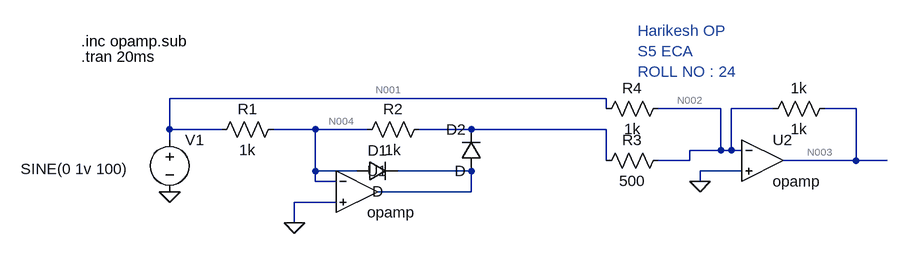
[diagram p0: schematic FULL_WAVE.asc]
FULL_WAVE.asc, the LTspice schematic file:
Version 4
SHEET 1 964 680
WIRE 528 112 -144 112
WIRE 528 128 528 112
WIRE 704 128 608 128
WIRE 784 128 720 128
WIRE 912 128 864 128
WIRE -144 160 -144 112
WIRE -64 160 -144 160
WIRE 80 160 16 160
WIRE 160 160 80 160
WIRE 320 160 240 160
WIRE 528 160 320 160
WIRE -144 176 -144 160
WIRE 704 192 704 128
WIRE 704 192 656 192
WIRE 720 192 720 128
WIRE 720 192 704 192
WIRE 736 192 720 192
WIRE 528 208 528 160
WIRE 656 208 656 192
WIRE 656 208 608 208
WIRE 912 208 912 128
WIRE 912 208 800 208
WIRE 960 208 912 208
WIRE 80 224 80 160
WIRE 144 224 80 224
WIRE 320 224 208 224
WIRE 736 224 672 224
WIRE 80 240 80 224
WIRE 112 240 80 240
WIRE 672 240 672 224
WIRE 320 256 320 224
WIRE 320 256 176 256
WIRE 112 272 48 272
WIRE 48 304 48 272
FLAG -144 256 0
FLAG 48 304 0
FLAG 672 240 0
SYMBOL OpAmps\\opamp 144 192 R0
SYMATTR InstName U1
SYMBOL voltage -144 160 R0
WINDOW 3 -229 61 Left 2
WINDOW 123 0 0 Left 0
WINDOW 39 0 0 Left 0
SYMATTR Value SINE(0 1v 100)
SYMATTR InstName V1
SYMBOL res 32 144 R90
WINDOW 0 0 56 VBottom 2
WINDOW 3 32 56 VTop 2
SYMATTR InstName R1
SYMATTR Value 1k
SYMBOL res 256 144 R90
WINDOW 0 0 56 VBottom 2
WINDOW 3 32 56 VTop 2
SYMATTR InstName R2
SYMATTR Value 1k
SYMBOL diode 144 240 R270
WINDOW 0 32 32 VTop 2
WINDOW 3 0 32 VBottom 2
SYMATTR InstName D1
SYMBOL diode 336 224 R180
WINDOW 0 24 64 Left 2
WINDOW 3 24 0 Left 2
SYMATTR InstName D2
SYMBOL OpAmps\\opamp 768 144 R0
SYMATTR InstName U2
SYMBOL res 624 192 R90
WINDOW 0 0 56 VBottom 2
WINDOW 3 32 56 VTop 2
SYMATTR InstName R3
SYMATTR Value 500
SYMBOL res 624 112 R90
WINDOW 0 0 56 VBottom 2
WINDOW 3 32 56 VTop 2
SYMATTR InstName R4
SYMATTR Value 1k
SYMBOL res 880 112 R90
WINDOW 0 0 56 VBottom 2
WINDOW 3 32 56 VTop 2
SYMATTR InstName 1k
SYMATTR Value 1k
TEXT 576 8 Left 2 ;Harikesh OP\nS5 ECA \nROLL NO : 24
TEXT -280 24 Left 2 !.inc opamp.sub
TEXT -280 48 Left 2 !.tran 20ms

The netlist it stands for:
* FULL_WAVE.asc
XU1 N004 0 N006 opamp Aol=100K GBW=10Meg  ; pins invin noninvin out
V1 N001 0 SINE(0 1v 100)
R1 N004 N001 1k
R2 N005 N004 1k
D1 N004 N006 D
D2 N006 N005 D
XU2 N002 0 N003 opamp Aol=100K GBW=10Meg  ; pins invin noninvin out
R3 N002 N005 500
R4 N002 N001 1k
R§1k N003 N002 1k
.model D D
.lib standard.dio
* Harikesh OP
* S5 ECA
* ROLL NO : 24
.inc opamp.sub
.tran 20ms
.backanno
.end

* Results of the author's LTspice run, read from the files saved beside the schematic
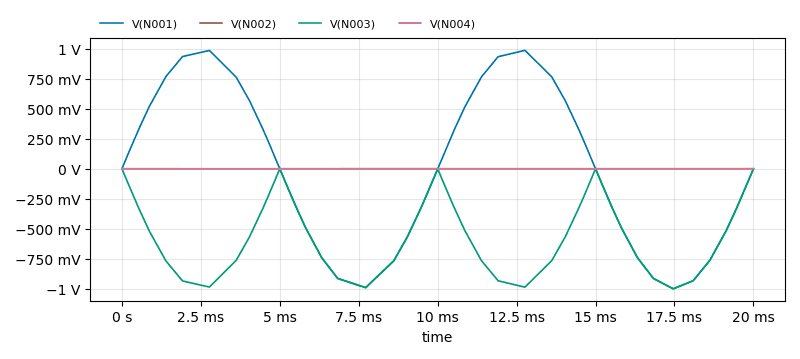
[diagram p1: Transient Analysis of FULL_WAVE.asc, plotted from the saved traces]
* Transient Analysis, 1 run:
*   V(N001): min -999.5 mV, max 985.9 mV, average -725.9 µV, rms 699.4 mV, last 0 V
*   V(N002): min -46.77 µV, max 223.1 µV, average 6.293 µV, rms 10.21 µV, last 5.872 µV
*   V(N003): min -999.4 mV, max 6.406 mV, average -627.4 mV, rms 699.4 mV, last -1.256 mV
*   V(N004): min -2.842 mV, max 2.818 mV, average -3.91 µV, rms 71.35 µV, last 319.8 µV